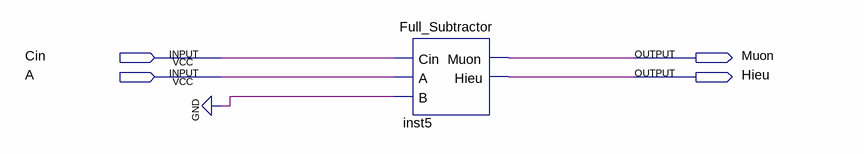
[diagram p0: schematic sheet]
// Quartus schematic DECREMENT-A.bdf as structural Verilog: 1 symbols, 4 pins
module \DECREMENT-A  (
  input  Cin,
  input  A,
  output Muon,
  output Hieu
);

  Full_Subtractor inst5 (.Cin(Cin), .A(A), .B(1'b0), .Muon(Muon), .Hieu(Hieu));
endmodule
